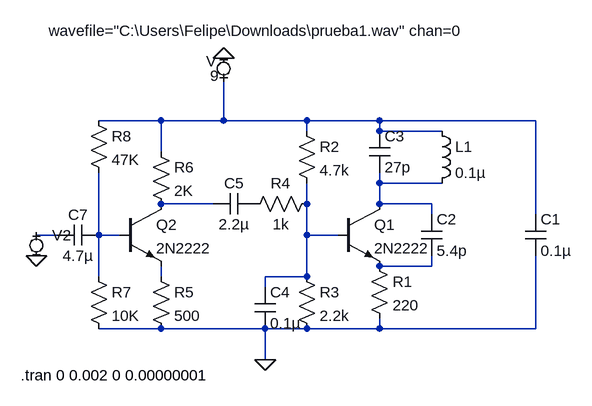
[diagram p0: schematic Draft1.asc]
Draft1.asc, the LTspice schematic file:
Version 4
SHEET 1 880 680
WIRE -208 -16 -304 -16
WIRE -112 -16 -112 -80
WIRE -112 -16 -208 -16
WIRE 16 -16 -112 -16
WIRE 128 -16 16 -16
WIRE 368 -16 128 -16
WIRE 16 0 16 -16
WIRE 128 0 128 -16
WIRE 224 0 128 0
WIRE -208 32 -208 -16
WIRE 128 80 128 64
WIRE 224 80 128 80
WIRE -128 112 -208 112
WIRE 16 112 16 80
WIRE 128 112 128 80
WIRE 208 112 128 112
WIRE 208 128 208 112
WIRE 368 128 368 -16
WIRE -368 160 -400 160
WIRE -304 160 -304 64
WIRE -272 160 -304 160
WIRE 16 160 16 112
WIRE 64 160 16 160
WIRE 208 208 208 192
WIRE 208 208 128 208
WIRE -304 224 -304 160
WIRE -208 224 -208 208
WIRE 16 224 16 160
WIRE 16 224 -48 224
WIRE -48 240 -48 224
WIRE -208 304 -304 304
WIRE -48 304 -208 304
WIRE 16 304 -48 304
WIRE 128 304 128 288
WIRE 128 304 16 304
WIRE 368 304 368 192
WIRE 368 304 128 304
WIRE -48 352 -48 304
FLAG -112 -112 0
FLAG -48 352 0
FLAG -400 192 0
SYMBOL cap 352 128 R0
SYMATTR InstName C1
SYMATTR Value 0.1µ
SYMBOL cap 192 128 R0
SYMATTR InstName C2
SYMATTR Value 5.4p
SYMBOL npn 64 112 R0
SYMATTR InstName Q1
SYMATTR Value 2N2222
SYMBOL cap 112 0 R0
SYMATTR InstName C3
SYMATTR Value 27p
SYMBOL ind 208 -16 R0
SYMATTR InstName L1
SYMATTR Value 0.1µ
SYMBOL res 112 192 R0
SYMATTR InstName R1
SYMATTR Value 220
SYMBOL res 0 -16 R0
SYMATTR InstName R2
SYMATTR Value 4.7k
SYMBOL res 0 208 R0
SYMATTR InstName R3
SYMATTR Value 2.2k
SYMBOL cap -64 240 R0
SYMATTR InstName C4
SYMATTR Value 0.1µ
SYMBOL res 32 96 R90
WINDOW 0 0 56 VBottom 2
WINDOW 3 32 56 VTop 2
SYMATTR InstName R4
SYMATTR Value 1k
SYMBOL cap -64 96 R90
WINDOW 0 0 32 VBottom 2
WINDOW 3 32 32 VTop 2
SYMATTR InstName C5
SYMATTR Value 2.2µ
SYMBOL res -224 208 R0
SYMATTR InstName R5
SYMATTR Value 500
SYMBOL npn -272 112 R0
SYMATTR InstName Q2
SYMATTR Value 2N2222
SYMBOL res -224 16 R0
SYMATTR InstName R6
SYMATTR Value 2K
SYMBOL res -320 208 R0
SYMATTR InstName R7
SYMATTR Value 10K
SYMBOL res -320 -32 R0
SYMATTR InstName R8
SYMATTR Value 47K
SYMBOL cap -304 144 R90
WINDOW 0 0 32 VBottom 2
WINDOW 3 32 32 VTop 2
SYMATTR InstName C7
SYMATTR Value 4.7µ
SYMBOL MiniSyms4\\voltage- -112 -96 R180
WINDOW 0 11 11 Left 2
WINDOW 3 7 -11 Left 2
SYMATTR InstName V
SYMATTR Value 9
SYMBOL MiniSyms4\\voltage- -400 176 R0
WINDOW 3 19 -330 Left 2
WINDOW 123 0 0 Left 2
WINDOW 39 0 0 Left 2
SYMATTR Value wavefile="C:\Users\Felipe\Downloads\prueba1.wav" chan=0
SYMATTR InstName V2
TEXT -424 376 Left 2 !.tran 0 0.002 0 0.00000001

The netlist it stands for:
* Draft1.asc
C1 N001 0 0.1µ
C2 N002 N007 5.4p
Q1 N002 N004 N007 0 2N2222
C3 N001 N002 27p
L1 N001 N002 0.1µ
R1 N007 0 220
R2 N001 N004 4.7k
R3 N004 0 2.2k
C4 N004 0 0.1µ
R4 N004 P001 1k
C5 P001 N003 2.2µ
R5 N008 0 500
Q2 N003 N006 N008 0 2N2222
R6 N001 N003 2K
R7 N006 0 10K
R8 N001 N006 47K
C7 N006 N005 4.7µ
V N001 0 9
V2 N005 0 wavefile="C:\Users\Felipe\Downloads\prueba1.wav" chan=0
.model NPN NPN
.model PNP PNP
.lib standard.bjt
.tran 0 0.002 0 0.00000001
.backanno
.end